# EAGLE schematic USB Load (EAGLE 9.4.0)
ERSTELLER: Jakob Holz; PROJEKT: USB Load; VERSION: 1.0
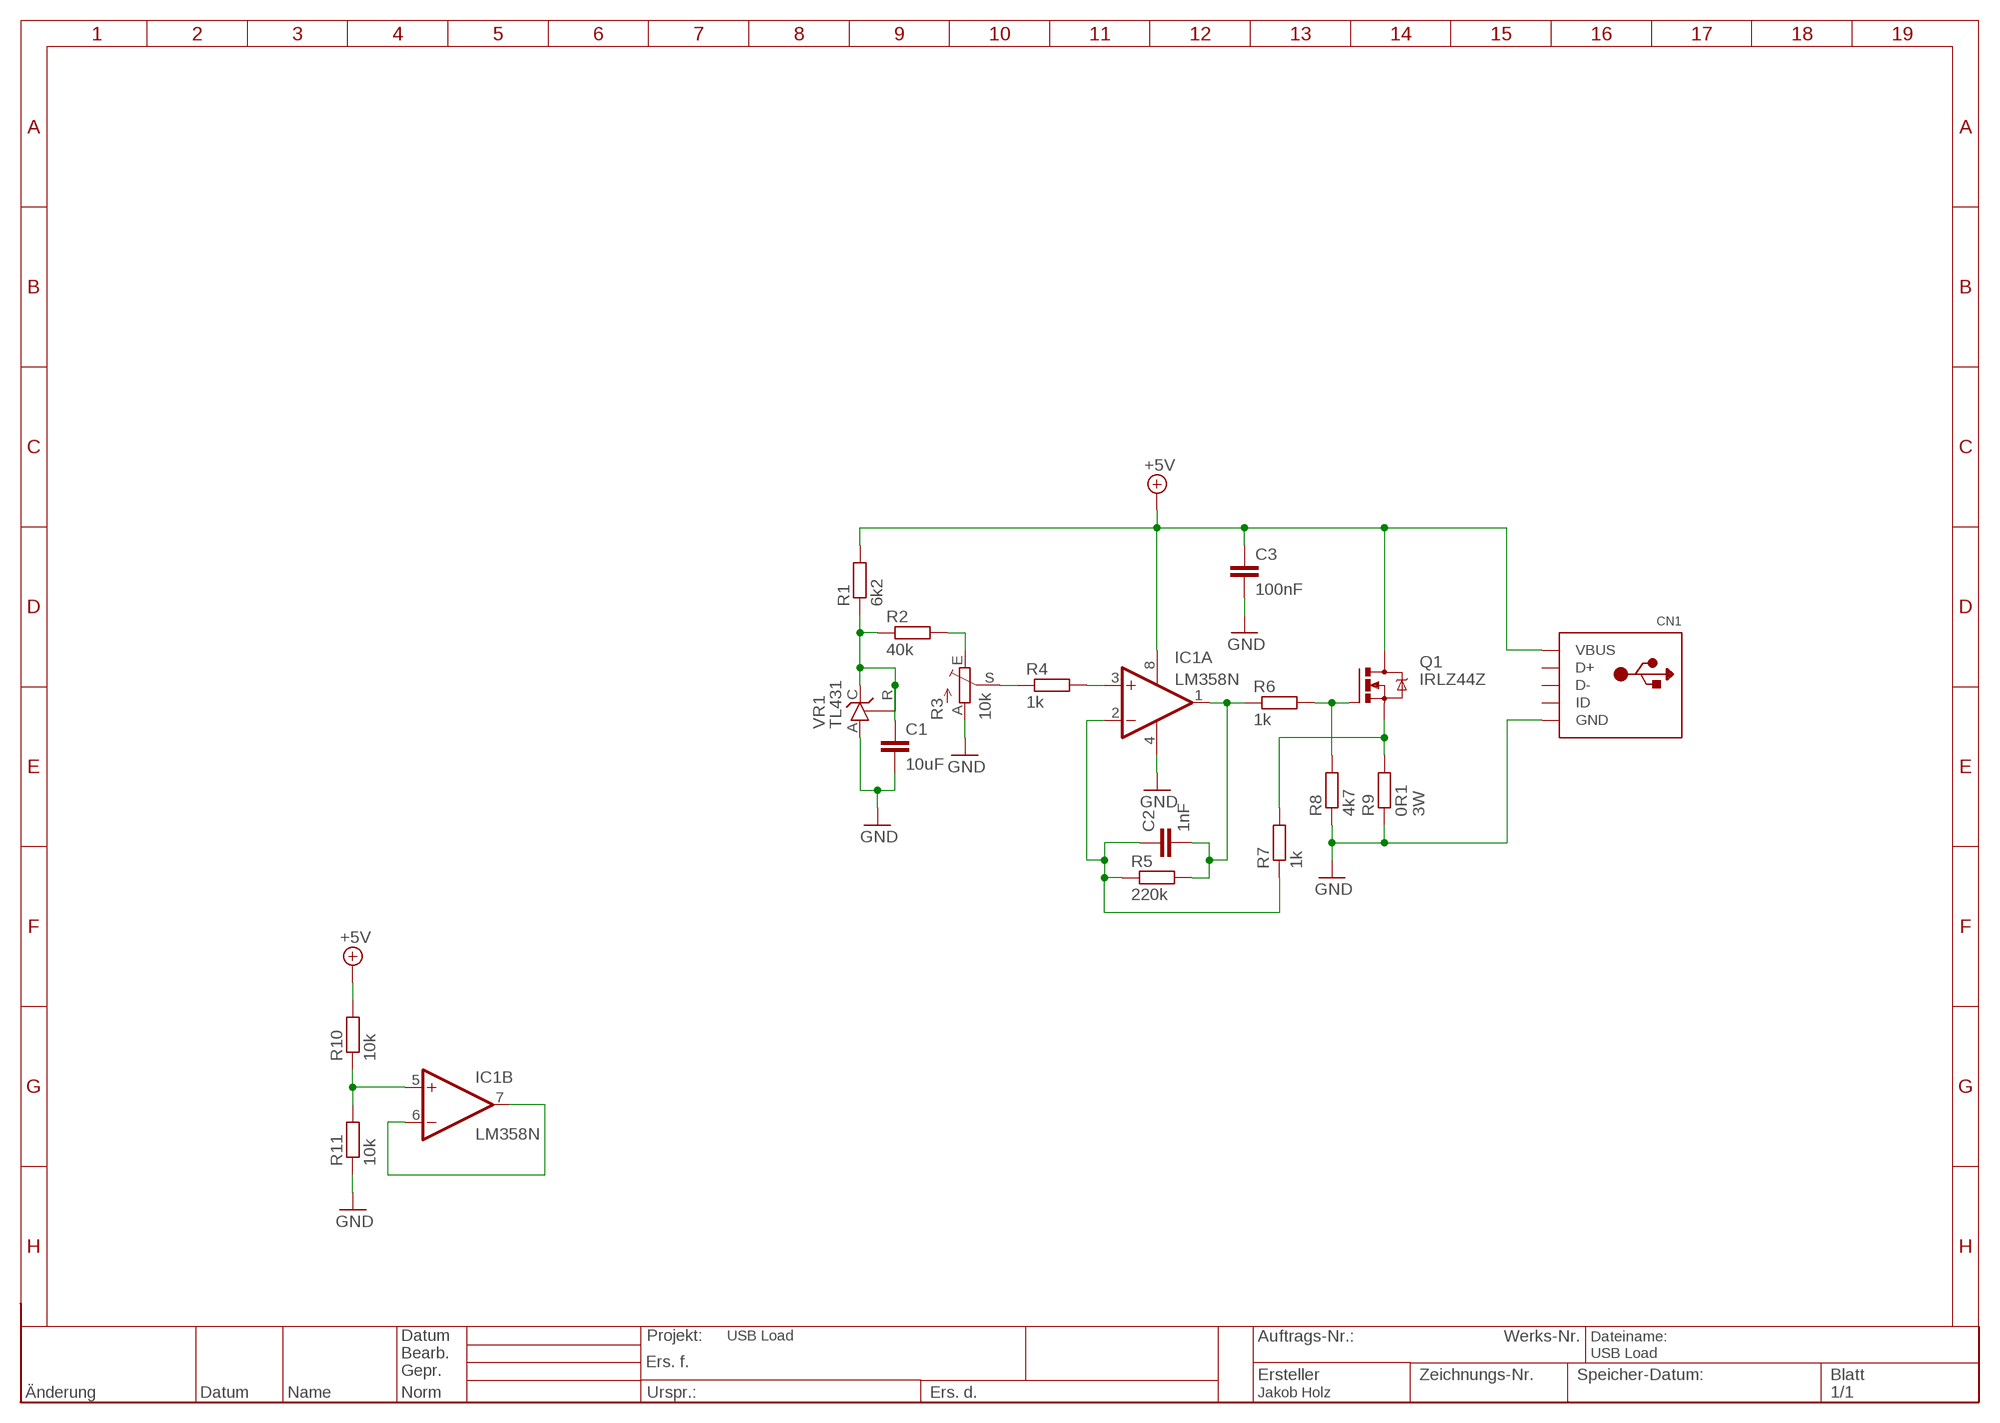
[diagram p0: schematic, sheet 1]
RAHMEN1 (RAHMEN_A4_8Z-19S): ERSTELLER: Jakob Holz; PROJEKT: USB Load

## Parts
C1  10uF  C-EUC1206  [C1206]
C2  1nF  C-EUC1206  [C1206]
C3  100nF  C-EUC1206  [C1206]
CN1  USBTHM  [USB-MINIB-THM]
IC1  LM358N  [DIL08]
Q1  IRLZ44Z  [TO220BH]
R1  6k2  R-EU_R1206  [R1206]
R2  40k  R-EU_R1206  [R1206]
R3  10k  TRIM_EU-RJ9W  [RJ9W]
R4  1k  R-EU_R1206  [R1206]
R5  220k  R-EU_R1206  [R1206]
R6  1k  R-EU_R1206  [R1206]
R7  1k  R-EU_R1206  [R1206]
R8  4k7  R-EU_R1206  [R1206]
R9  0R1  R-EU_R1206  [R1206]
R10  10k  R-EU_R1206  [R1206]
R11  10k  R-EU_R1206  [R1206]
VR1  TL431  TL431CLP  [TO92-CLP]

## Nets
+5V: C3.1 CN1.VBUS IC1.8(P:V+) Q1.D R1.2 R10.2
GND: C1.2 C3.2 CN1.GND IC1.4(P:V-) R3.A R8.1 R9.1 R11.1 VR1.A
N$1: C1.1 R1.1 R2.1 VR1.C VR1.R
N$2: R2.2 R3.E
N$3: C2.2 IC1.1(A:OUT) R5.2 R6.1
N$4: R3.S R4.1
N$5: IC1.3(A:+IN) R4.2
N$7: Q1.G R6.2 R8.2
N$8: C2.1 IC1.2(A:-IN) R5.1 R7.1
N$9: Q1.S R7.2 R9.2
N$10: IC1.6(B:-IN) IC1.7(B:OUT)
N$11: IC1.5(B:+IN) R10.1 R11.2
Unconnected: CN1.D+ CN1.D- CN1.ID

## Notes on the sheet
- 3W

## Library data of the parts
C1-C3 = rcl:C-EU: CAPACITOR, European symbol; SPICEPREFIX: C
CN1 = adafruit:USB: USB Connectors USBMINIB - Surface Mount Female Mini-B USB Connector 4UConnector: 06564 By microbuilder.eu Thru-hole RA Female Mini-B USB Connector 4UConnector: 18732 By ladyada.net
IC1 = linear:LM358: OP AMP also LM158; LM258; LM2904 Source: http://cache.national.com/ds/LM/LM158.pdf
Q1 = transistor-power:IRLZ44Z: N-Channel HEXFET® Power MOSFET Logic Level AUTOMOTIVE MOSFET Source: http://www.irf.com/product-info/datasheets/data/irlz44zpbf.pdf
R1 R2 R4-R11 = rcl:R-EU_: RESISTOR, European symbol; SPICEPREFIX: R
R3 = pot:TRIM_EU-: POTENTIOMETER
VR1 = v-reg:TL431CLP: VOLTAGE REGULATOR